# Altium project THERMO_RTD_SENSOR_2CH.PrjPcb
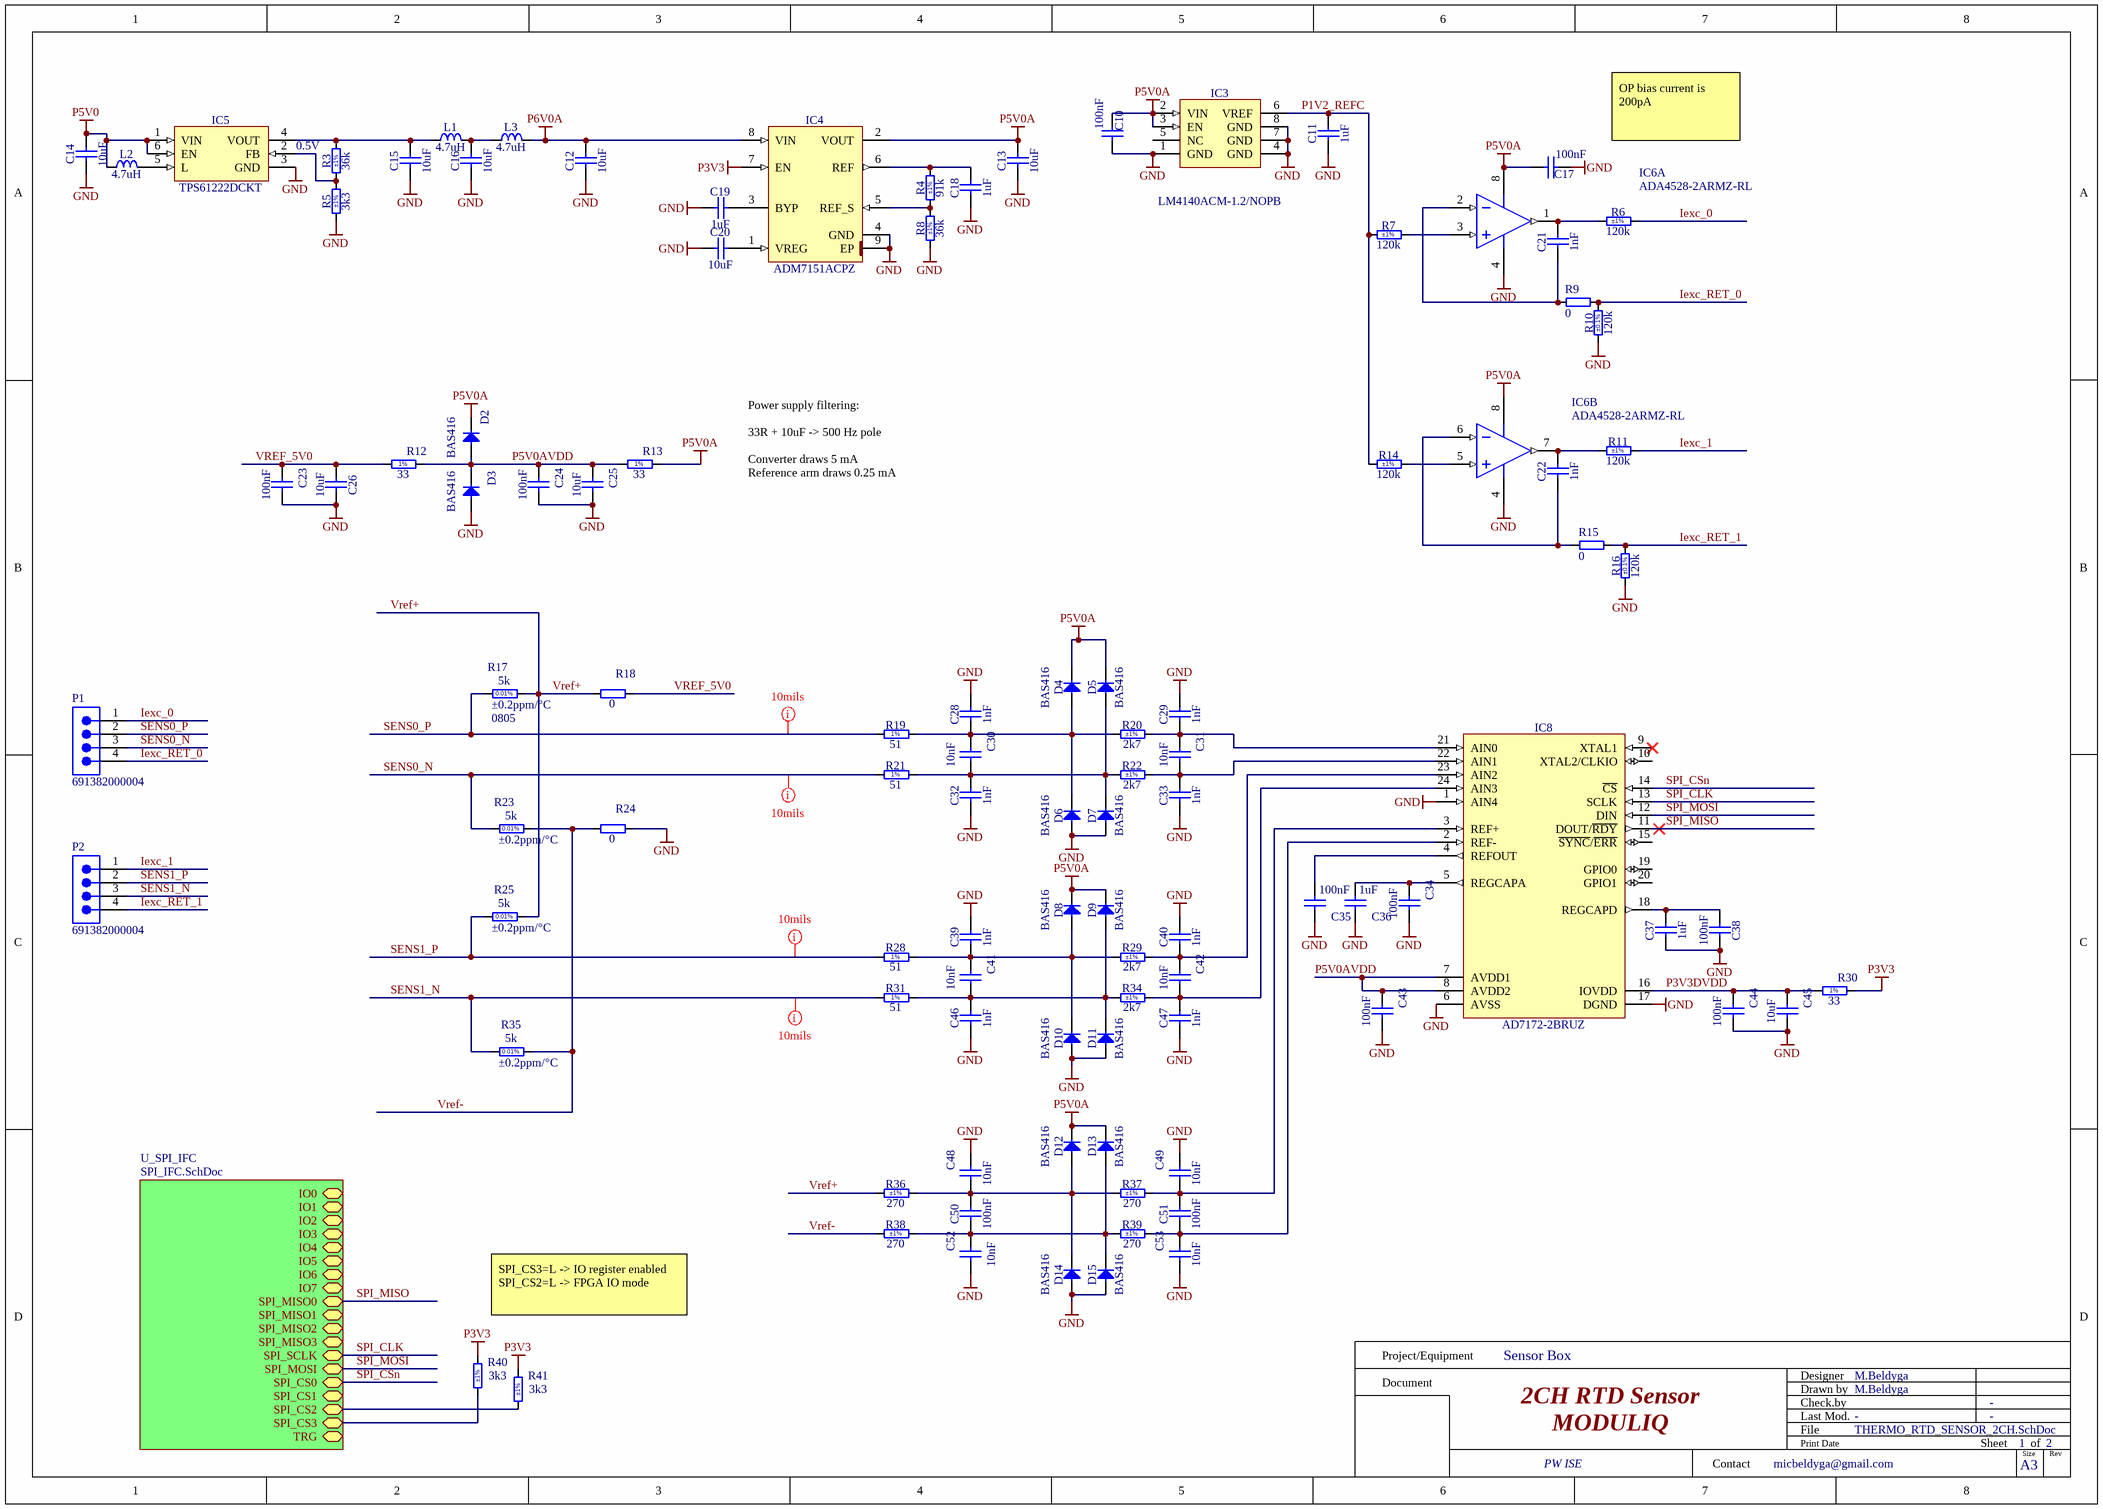
[diagram p0: THERMO_RTD_SENSOR_2CH.SchDoc]
2 sheets, 154 parts. Net scope: hierarchical (ports join the sheet entries above them; power ports are global).
Board file: MODULIQ_Thermometer.PcbDoc
Sheets:
  THERMO_RTD_SENSOR_2CH.SchDoc
    U_SPI_IFC = SPI_IFC.SchDoc

## Sheet THERMO_RTD_SENSOR_2CH.SchDoc: 2CH RTD Sensor
size A3; Author: M.Beldyga; CompanyName: WUT ISE; DrawnBy: M.Beldyga; Organization: WUT ISE; Address1: PW ISE; Address2: Nowowiejska 15/19 00-665 Warsaw; Address3: micbeldyga@gmail.com; SheetNumber: 1; SheetTotal: 2; ModifiedBy: -; CheckedDate: -; Title2: MODULIQ; DivGrp: WUT ISE; Designer: M.Beldyga; ModifiedDate: -; ProjectName: Sensor Box

### Parts
C10  100nF  [CAPC1005X55N]
C11  1uF  [CAPC1608X87N]
C12  10uF  [CAPC1608X80N]
C13  10uF  [CAPC1608X80N]
C14  10uF  [CAPC1608X80N]
C15  10uF  [CAPC1608X80N]
C16  10uF  [CAPC1608X80N]
C17  100nF  [CAPC1005X55N]
C18  1uF  [CAPC1005X55N]
C19  1uF  [CAPC1005X55N]
C20  10uF  [CAPC1608X80N]
C21  1nF  [CAPC1005X55N]
C22  1nF  [CAPC1005X55N]
C23  100nF  [CAPC1005X55N]
C24  100nF  [CAPC1005X55N]
C25  10uF  [CAPC2012X135N]
C26  10uF  [CAPC2012X135N]
C28  1nF  [CAPC1608X90N]
C29  1nF  [CAPC1608X90N]
C30  10nF  [CAPC1608X87N]
C31  10nF  [CAPC1608X87N]
C32  1nF  [CAPC1608X90N]
C33  1nF  [CAPC1608X90N]
C34  100nF  [CAPC1005X55N]
C35  100nF  [CAPC1005X55N]
C36  1uF  [CAPC1608X87N]
C37  1uF  [CAPC1608X87N]
C38  100nF  [CAPC1005X55N]
C39  1nF  [CAPC1608X90N]
C40  1nF  [CAPC1608X90N]
C41  10nF  [CAPC1608X87N]
C42  10nF  [CAPC1608X87N]
C43  100nF  [CAPC1005X55N]
C44  100nF  [CAPC1005X55N]
C45  10uF  [CAPC2012X135N]
C46  1nF  [CAPC1608X90N]
C47  1nF  [CAPC1608X90N]
C48  10nF  [CAPC1608X87N]
C49  10nF  [CAPC1608X87N]
C50  100nF  [CAPC1608X87N]
C51  100nF  [CAPC1608X87N]
C52  10nF  [CAPC1608X87N]
C53  10nF  [CAPC1608X87N]
D2  BAS416  [SOD2512X110N]
D3  BAS416  [SOD2512X110N]
D4  BAS416  [SOD2512X110N]
D5  BAS416  [SOD2512X110N]
D6  BAS416  [SOD2512X110N]
D7  BAS416  [SOD2512X110N]
D8  BAS416  [SOD2512X110N]
D9  BAS416  [SOD2512X110N]
D10  BAS416  [SOD2512X110N]
D11  BAS416  [SOD2512X110N]
D12  BAS416  [SOD2512X110N]
D13  BAS416  [SOD2512X110N]
D14  BAS416  [SOD2512X110N]
D15  BAS416  [SOD2512X110N]
IC3  LM4140ACM-1.2/NOPB  [SOIC127P600X175-8N]
IC4  ADM7151ACPZ  [SON50P300X300X80-9N-R170X244]
IC5  TPS61222DCKT  [SOT65P210X110-6N]
IC6  ADA4528-2ARMZ-RL  [ADI-RM-8_N]  (parts A,B of 2)
IC8  AD7172-2BRUZ  [SOP65P640X120-24N]
L1  4.7uH  [INDC2520X120N]
L2  4.7uH  [INDC2520X120N]
L3  4.7uH  [INDC2520X120N]
P1  691382000004  [691382000004]
P2  691382000004  [691382000004]
R3  36k  Tolerance: ±1%  [RESC1005X40N]
R4  91k  Tolerance: ±1%  [RESC1005X40N]
R5  3k3  Tolerance: ±1%  [RESC1005X40N]
R6  120k  Tolerance: ±1%  [RESC1005X40N]
R7  120k  Tolerance: ±1%  [RESC1005X40N]
R8  36k  Tolerance: ±1%  [RESC1005X40N]
R9  0  [RESC1005X40N]
R10  120k  Tolerance: ±0.1%  [RESC2012X60N]
R11  120k  Tolerance: ±1%  [RESC1005X40N]
R12  33  [RESC1005X40N]
R13  33  [RESC1005X40N]
R14  120k  Tolerance: ±1%  [RESC1005X40N]
R15  0  [RESC1005X40N]
R16  120k  Tolerance: ±0.1%  [RESC2012X60N]
R17  5k  TC: ±0.2ppm/°C  Case: 0805  [RESC2013X64N]
R18  0  [RESC1608X55N]
R19  51  [RESC1005X40N]
R20  2k7  Tolerance: ±1%  [RESC1005X40N]
R21  51  [RESC1005X40N]
R22  2k7  Tolerance: ±1%  [RESC1005X40N]
R23  5k  TC: ±0.2ppm/°C  [RESC2013X64N]
R24  0  [RESC1608X55N]
R25  5k  TC: ±0.2ppm/°C  [RESC2013X64N]
R28  51  [RESC1005X40N]
R29  2k7  Tolerance: ±1%  [RESC1005X40N]
R30  33  [RESC1005X40N]
R31  51  [RESC1005X40N]
R34  2k7  Tolerance: ±1%  [RESC1005X40N]
R35  5k  TC: ±0.2ppm/°C  [RESC2013X64N]
R36  270  Tolerance: ±1%  [RESC1005X40N]
R37  270  Tolerance: ±1%  [RESC1005X40N]
R38  270  Tolerance: ±1%  [RESC1005X40N]
R39  270  Tolerance: ±1%  [RESC1005X40N]
R40  3k3  Tolerance: ±1%  [RESC1005X40N]
R41  3k3  Tolerance: ±1%  [RESC1005X40N]

### Sub-sheets
U_SPI_IFC = SPI_IFC.SchDoc: IO0 (bidir), IO1 (bidir), IO2 (bidir), IO3 (bidir), IO4 (bidir), IO5 (bidir), IO6 (bidir), IO7 (bidir), SPI_MISO0 (bidir), SPI_MISO1 (bidir), SPI_MISO2 (bidir), SPI_MISO3 (bidir), SPI_SCLK (bidir), SPI_MOSI (bidir), SPI_CS0 (bidir), SPI_CS1 (bidir), SPI_CS2 (bidir), SPI_CS3 (bidir), TRG (bidir)

### Nets
GND: C10.2 C11.1 C12.1 C13.1 C14.1 C15.1 C16.1 C17.1 C18.1 C19.1 C20.1 C23.2 C24.2 C25.2 C26.2 C28.2 C29.2 C32.1 C33.1 C34.2 C35.2 C36.1 C37.1 C38.2 C39.2 C40.2 C43.2 C44.2 C45.2 C46.1 C47.1 C48.2 C49.2 C52.1 C53.1 D3.2(A) D6.2(A) D7.2(A) D10.2(A) D11.2(A) D14.2(A) D15.2(A) IC3.1(GND) IC3.4(GND) IC3.7(GND) IC3.8(GND) IC4.4(GND) IC4.9(EP) IC5.3(GND) IC6.4(-V) IC8.1(AIN4) IC8.6(AVSS) IC8.17(DGND) R5.1 R8.1 R10.1 R16.1 R24.2
P3V3: IC4.7(EN) R30.2 R40.1 R41.1
P5V0: C14.2 IC5.1(VIN) IC5.6(EN) L2.1
P5V0A: C10.1 C13.2 C17.2 D2.1(C) D4.1(C) D5.1(C) D8.1(C) D9.1(C) D12.1(C) D13.1(C) IC3.2(VIN) IC3.3(EN) IC4.2(VOUT) IC6.8(+V) R13.2
P6V0A: C12.2 IC4.8(VIN) L3.2
Iexc_0: P1.1 R6.2
Iexc_1: P2.1 R11.2
Iexc_RET_0: P1.4 R9.2 R10.2
Iexc_RET_1: P2.4 R15.2 R16.2
P1V2_REFC: C11.2 IC3.6(VREF) R7.1 R14.1
P3V3DVDD: C44.1 C45.1 IC8.16(IOVDD) R30.1
P5V0AVDD: C24.1 C25.1 C43.1 D2.2(A) D3.1(C) IC8.7(AVDD1) IC8.8(AVDD2) R12.2 R13.1
SENS0_N: P1.3 R21.1 R23.1
SENS0_P: P1.2 R17.1 R19.1
SENS1_N: P2.3 R31.1 R35.1
SENS1_P: P2.2 R25.1 R28.1
SPI_CLK: IC8.13(SCLK) ; sheet U_SPI_IFC/SPI_SCLK
SPI_CS2: R41.2 ; sheet U_SPI_IFC/SPI_CS2
SPI_CS3: R40.2 ; sheet U_SPI_IFC/SPI_CS3
SPI_CSn: IC8.14(~{CS}) ; sheet U_SPI_IFC/SPI_CS0  [project net SPI_CS0]
SPI_MISO: IC8.11(DOUT/~{RDY}) ; sheet U_SPI_IFC/SPI_MISO0
SPI_MOSI: IC8.12(DIN) ; sheet U_SPI_IFC/SPI_MOSI
Vref+: R17.2 R18.1 R25.2 R36.1
Vref-: R23.2 R24.1 R35.2 R38.1
VREF_5V0: C23.1 C26.1 R12.1 R18.2
NetC15_2: C15.2 IC5.4(VOUT) L1.1 R3.2
NetC16_2: C16.2 L1.2 L3.1
NetC18_2: C18.2 IC4.6(REF) R4.2
NetC19_2: C19.2 IC4.3(BYP)
NetC20_2: C20.2 IC4.1(VREG)
NetC21_1: C21.1 IC6.2(-IN_A) R9.1
NetC21_2: C21.2 IC6.1(OUT_A) R6.1
NetC22_1: C22.1 IC6.6(-IN_B) R15.1
NetC22_2: C22.2 IC6.7(OUT_B) R11.1
NetC28_1: C28.1 C30.1 D4.2(A) D6.1(C) R19.2 R20.1
NetC29_1: C29.1 C31.1 IC8.21(AIN0) R20.2
NetC30_2: C30.2 C32.2 D5.2(A) D7.1(C) R21.2 R22.1
NetC31_2: C31.2 C33.2 IC8.22(AIN1) R22.2
NetC34_1: C34.1 C36.2 IC8.5(REGCAPA)
NetC35_1: C35.1 IC8.4(REFOUT)
NetC37_2: C37.2 C38.1 IC8.18(REGCAPD)
NetC39_1: C39.1 C41.1 D8.2(A) D10.1(C) R28.2 R29.1
NetC40_1: C40.1 C42.1 IC8.23(AIN2) R29.2
NetC41_2: C41.2 C46.2 D9.2(A) D11.1(C) R31.2 R34.1
NetC42_2: C42.2 C47.2 IC8.24(AIN3) R34.2
NetC48_1: C48.1 C50.2 D12.2(A) D14.1(C) R36.2 R37.1
NetC49_1: C49.1 C51.2 IC8.3(REF+) R37.2
NetC50_1: C50.1 C52.2 D13.2(A) D15.1(C) R38.2 R39.1
NetC51_1: C51.1 C53.2 IC8.2(REF-) R39.2
NetIC4_5: IC4.5(REF_S) R4.1 R8.2
NetIC5_2: IC5.2(FB) R3.1 R5.2
NetIC5_5: IC5.5(L) L2.2
NetIC6_3: IC6.3(+IN_A) R7.2
NetIC6_5: IC6.5(+IN_B) R14.2

Not connected (* = marked no-connect by the designer): IC3 5(NC); IC8 9(XTAL1)* 10(XTAL2/CLKIO) 15(~{SYNC}/~{ERR}) 19(GPIO0) 20(GPIO1)

### Layout directives
rule Width Constraint [Pref Width = 10mil    Min Width = 10mil    Max Width = 15mil]: SENS0_N, SENS0_P, SENS1_N, SENS1_P

### Notes on the sheet
- 0.5V
- OP bias current is 200pA
- Power supply filtering:
  33R + 10uF -> 500 Hz pole
  Converter draws 5 mA
  Reference arm draws 0.25 mA
- SPI_CS3=L -> IO register enabled
  SPI_CS2=L -> FPGA IO mode
- Project/Equipment
- Document
- Designer
- Drawn by
- Check.by
- Contact
- File
- Last Mod.
- Print Date
- Sheet
- Size
- A3
- of
- Rev
- (in symbol R0402_33R_1%_0.0625W_100PPM) 1%
- (in symbol R0402_51R_1%_0.0625W_100PPM) 1%
- (in symbol R0805_5K_0.01%_0.2W_0.2PPM_VISHAY_VSMP) 0.01%

### Library data of the parts
C10 C17 = CC0402_100NF_16V_10%_X5R: Non-polarised capacitor; Part Description: SMD Multilayer Chip Ceramic Capacitor; Manufacturer: GENERIC; Manufacturer1 Part Number: GRM155R61C104KA88D; Voltage: 16V; TC: X5R; Tolerance: ±10%; Part Number: CC0402_100NF_16V_10%_X5R; Component Kind: Standard; Component Type: Standard; Pin Count: 2; Value: 100nF; Status: None; Manufacturer Part Number: CC0402_100NF_16V_10%_X5R; Case: 0402; Mounted: Yes; Socket: No; SMD: Yes; Sense: No; Manufacturer1 Example: MURATA; Manufacturer1 ComponentHeight: 0.55mm; HelpURL: \\cern.ch\dfs\Applications\Altium\Datasheets\CC0402_X5R_MURATA_GRM.pdf; Author: CERN DEM JLC; CreateDate: 10.12.2013; LatestRevisionDate: 10.12.2013
C11 C36 C37 = CC0603_1UF_25V_10%_X7R: Non-polarised capacitor; Part Description: SMD Multilayer Chip Ceramic Capacitor; Manufacturer: GENERIC; Manufacturer1 Part Number: GRM188R71E105KA12D; Voltage: 25V; TC: X7R; Tolerance: ±10%; Part Number: CC0603_1UF_25V_10%_X7R; Component Kind: Standard; Component Type: Standard; Pin Count: 2; Value: 1uF; Status: None; Manufacturer Part Number: CC0603_1UF_25V_10%_X7R; Case: 0603; Mounted: Yes; Socket: No; SMD: Yes; Sense: No; Manufacturer1 Example: MURATA; Manufacturer1 ComponentHeight: 0.9mm; HelpURL: \\cern.ch\dfs\Applications\Altium\Datasheets\CC0603_X7R_MURATA.pdf; Author: CERN DEM JLC; CreateDate: 18/01/2011; LatestRevisionDate: 18/01/2011
C12-C16 C20 = CC0603_10UF_10V_10%_X5R: Non-polarised capacitor; Part Description: SMD Multilayer Chip Ceramic Capacitor; Manufacturer: GENERIC; Manufacturer1 Part Number: GRM188R61A106KE69D; Voltage: 10V; TC: X5R; Tolerance: ±10%; Part Number: CC0603_10UF_10V_10%_X5R; Component Kind: Standard; Component Type: Standard; Pin Count: 2; Value: 10uF; Status: None; Manufacturer Part Number: CC0603_10UF_10V_10%_X5R; Case: 0603; Mounted: Yes; Socket: No; SMD: Yes; Sense: No; Manufacturer1 Example: MURATA; Manufacturer1 ComponentHeight: 0.8mm; HelpURL: \\cern.ch\dfs\Applications\Altium\Datasheets\CC0603_MURATA_GRM188R61A106KE69D.pdf; Author: CERN DEM JLC; CreateDate: 31.01.2017; LatestRevisionDate: 31.01.2017
C18 C19 = CC0402_1UF_16V_10%_X5R: Non-polarised capacitor; Part Description: SMD Multilayer Chip Ceramic Capacitor; Manufacturer: GENERIC; Manufacturer1 Part Number: C1005X5R1C105KT; Voltage: 16V; TC: X5R; Tolerance: ±10%; Part Number: CC0402_1UF_16V_10%_X5R; Component Kind: Standard; Component Type: Standard; Pin Count: 2; Value: 1uF; Status: Preferred; Manufacturer Part Number: CC0402_1UF_16V_10%_X5R; Case: 0402; Mounted: Yes; Socket: No; SMD: Yes; Sense: No; Manufacturer1 Example: TDK; Manufacturer1 ComponentHeight: 0.55mm; HelpURL: \\cern.ch\dfs\Applications\Altium\Datasheets\CC0402_X5R_TDK_C.pdf; Author: CERN DEM JLC; CreateDate: 25.10.2012; LatestRevisionDate: 25.10.2012
C21 C22 = CC0402_1NF_50V_10%_X7R: Non-polarised capacitor; Part Description: SMD Multilayer Chip Ceramic Capacitor; Manufacturer: GENERIC; Manufacturer1 Part Number: 223858715623; Voltage: 50V; TC: X7R; Tolerance: ±10%; Part Number: CC0402_1NF_50V_10%_X7R; Component Kind: Standard; Component Type: Standard; Pin Count: 2; Value: 1nF; Status: Not Recommended; Manufacturer Part Number: CC0402_1NF_50V_10%_X7R; Case: 0402; Mounted: Yes; Socket: No; SMD: Yes; Sense: No; Manufacturer1 Example: PHYCOMP; Manufacturer1 ComponentHeight: 0.55mm; HelpURL: \\cern.ch\dfs\Applications\Altium\Datasheets\CC0402_X7R_PHYCOMP.pdf; Author: CERN DEM JLC; CreateDate: 03/12/2007; LatestRevisionDate: 03/12/2007
C23 C24 C34 C35 C38 C43 C44 = CC0402_100NF_16V_10%_X5R: Non-polarised capacitor; Part Description: SMD Multilayer Chip Ceramic Capacitor; Manufacturer: GENERIC; Manufacturer1 Part Number: GRM155R61C104KA88D; Voltage: 16V; TC: X5R; Tolerance: ±10%; Table: Capacitors SMD; Part Number: CC0402_100NF_16V_10%_X5R; Component Kind: Standard; Component Type: Standard; Pin Count: 2; Value: 100nF; Status: None; Manufacturer Part Number: CC0402_100NF_16V_10%_X5R; Case: 0402; Mounted: Yes; Socket: No; SMD: Yes; Manufacturer1 Example: MURATA; Manufacturer1 ComponentHeight: 0.55mm; HelpURL: \\cern.ch\dfs\Applications\Altium\Datasheets\CC0402_X5R_MURATA_GRM.pdf; Author: CERN DEM JLC; CreateDate: 2013-12-10; LatestRevisionDate: 2013-12-10
C25 C26 C45 = CC0805_10UF_16V_10%_X5R: Non-polarised capacitor; Part Description: SMD Multilayer Chip Ceramic Capacitor; Manufacturer: GENERIC; Manufacturer1 Part Number: C0805C106K4PAC; Voltage: 16V; TC: X5R; Tolerance: ±10%; Part Number: CC0805_10UF_16V_10%_X5R; Component Kind: Standard; Component Type: Standard; Pin Count: 2; Value: 10uF; Status: Preferred; Manufacturer Part Number: CC0805_10UF_16V_10%_X5R; Case: 0805; Mounted: Yes; Socket: No; SMD: Yes; Manufacturer1 Example: KEMET; Manufacturer1 ComponentHeight: 1.4mm; HelpURL: \\cern.ch\dfs\Applications\Altium\Datasheets\CC1206_X5R_KEMET.pdf; Author: CERN DEM JLC; CreateDate: 03.12.2007; LatestRevisionDate: 03.12.2007; Sense: No
C28 C29 C32 C33 C39 C40 C46 C47 = CC0603_1NF_50V_5%_NP0: Non-polarised capacitor; Part Description: SMD Multilayer Chip Ceramic Capacitor; Manufacturer: GENERIC; Manufacturer1 Part Number: CC0603JRNPO9BN102; Voltage: 50V; TC: C0G/NP0; Tolerance: ±5%; Part Number: CC0603_1NF_50V_5%_NP0; Component Kind: Standard; Component Type: Standard; Pin Count: 2; Value: 1nF; Status: Preferred; Manufacturer Part Number: CC0603_1NF_50V_5%_NP0; Case: 0603; Mounted: Yes; Socket: No; SMD: Yes; Sense: No; Manufacturer1 Example: YAGEO PHYCOMP; Manufacturer1 ComponentHeight: 0.9mm; HelpURL: \\cern.ch\dfs\Applications\Altium\Datasheets\CC0805_NP0_PHYCOMP_16VTO50V.pdf; Author: CERN DEM JLC; CreateDate: 22.10.2012; LatestRevisionDate: 22.10.2012
C30 C31 C41 C42 C48 C49 C52 C53 = CC0603_10NF_50V_5%_C0G: Non-polarised capacitor; Part Description: SMD Multilayer Chip Ceramic Capacitor; Manufacturer: GENERIC; Manufacturer1 Part Number: C1608C0G1H103J080AA; Voltage: 50V; TC: C0G/NP0; Tolerance: ±5%; Part Number: CC0603_10NF_50V_5%_C0G; Component Kind: Standard; Component Type: Standard; Pin Count: 2; Value: 10nF; Status: Preferred; Manufacturer Part Number: CC0603_10NF_50V_5%_C0G; Case: 0603; Mounted: Yes; Socket: No; SMD: Yes; Manufacturer1 Example: TDK; Manufacturer1 ComponentHeight: 0.9mm; HelpURL: \\cern.ch\dfs\Applications\Altium\Datasheets\CC0603_C0G_TDK_C.pdf; Author: CERN DEM JLC; Sense: No
  C30 C31 C41 C42: CreateDate: 10.12.2014; LatestRevisionDate: 10.12.2014
  C48 C49 C52 C53: CreateDate: 10/12/2014; LatestRevisionDate: 10/12/2014
C50 C51 = CC0603_100NF_50V_10%_X5R: Non-polarised capacitor; Part Description: SMD Multilayer Chip Ceramic Capacitor; Manufacturer: GENERIC; Manufacturer1 Part Number: C1608X5R1H104K080; Voltage: 50V; TC: X5R; Tolerance: ±10%; Part Number: CC0603_100NF_50V_10%_X5R; Component Kind: Standard; Component Type: Standard; Pin Count: 2; Value: 100nF; Status: None; Manufacturer Part Number: CC0603_100NF_50V_10%_X5R; Case: 0603; Mounted: Yes; Socket: No; SMD: Yes; Sense: No; Manufacturer1 Example: TDK; Manufacturer1 ComponentHeight: 0.9mm; HelpURL: \\cern.ch\dfs\Applications\Altium\Datasheets\CC0603_X5R_TDK_C.pdf; Author: CERN DEM MR; CreateDate: 08.01.2016; LatestRevisionDate: 08.01.2016
D2-D15 = BAS416: Diode; Part Description: Low-Leakage Diode; Manufacturer: NXP SEMICONDUCTORS; Voltage: 75V; Power: 200mA; PressFit: No; Bonding: No; Part Number: BAS416; Component Kind: Standard; Component Type: Standard; Device: BAS416; PackageDescription: Small Outline Diode (SOD-323), 1.70mm W X 1.25mm L X 1.10mm H body,  IPC Medium Density; Manufacturer Part Number: BAS416; Pin Count: 2; Case: SOD323; Mounted: Yes; Socket: No; SMD: Yes; Sense: No; ComponentHeight: 1.1mm; HelpURL: \\cern.ch\dfs\Applications\Altium\Datasheets\BAS416.pdf; Author: CERN DEM JLC; CreateDate: 01/10/2013; LatestRevisionDate: 01/10/2013
IC3 = LM4140ACM-1.2/NOPB: High Precision Low Noise Low Dropout Voltage Reference; Part Description: 1.2V 0.1% 3 ppm/°C, High Precision Low Noise Low Dropout Voltage Reference; Manufacturer: TEXAS INSTRUMENTS; PressFit: No; Bonding: No; Part Number: LM4140ACM-1.2/NOPB; Component Kind: Standard; Component Type: Standard; Device: LM4140ACM-1.2/NOPB; PackageDescription: SOIC 8, Pitch 1.27mm, Body 4x5mm, IPC Medium Density; Manufacturer Part Number: LM4140ACM-1.2/NOPB; Pin Count: 8; Case: SOIC8; Mounted: Yes; Socket: No; SMD: Yes; Sense: No; ComponentHeight: 1.75mm; HelpURL: \\cern.ch\dfs\Applications\Altium\Datasheets\LM4140ACM-1.2-NOPB.pdf; Author: CERN DEM JLC; CreateDate: 17.11.2014; LatestRevisionDate: 17.11.2014
IC4 = ADM7151ACPZ: 800 mA Ultralow Noise, High PSRR, RF Linear Regulator; Part Description: Adjustable 1.5V to 5.1V, 800 mA Ultralow Noise, High PSRR, RF Linear Regulator; Manufacturer: ANALOG DEVICES; PressFit: No; Bonding: No; Part Number: ADM7151ACPZ; Component Kind: Standard; Component Type: Standard; Device: ADM7151ACPZ; PackageDescription: SON, (DFN) 0.50mm Pitch; 8 pin, 3.00mm W X 3.00mm L X 0.80mm H body (w/Thermal Tab 1.70 X2.44mm), IPC Medium Density; Manufacturer Part Number: ADM7151ACP; Pin Count: 9; Case: SON8; Mounted: Yes; Socket: No; SMD: Yes; Sense: No; ComponentHeight: 0.8mm; HelpURL: \\cern.ch\dfs\Applications\Altium\Datasheets\ADM7151ACPZ.pdf; Author: CERN DEM JLC; CreateDate: 23.04.2015; LatestRevisionDate: 31.03.2022
IC5 = TPS61222DCKT: Low Input Voltage, 0.7V Boost Converter With 5.5uA Quiescent Current; Manufacturer: TEXAS INSTRUMENTS; PressFit: No; Bonding: No; Part Number: TPS61222DCKT; Component Kind: Standard; Component Type: Standard; Device: TPS61222DCKT; PackageDescription: SOT353, SC70-6, 0.65mm Pitch; 6 Pin, 1.25mm W X 2.00mm L X 1.10mm H body, IPC Medium Density; Part Description: Low Input Voltage, 0.7V Boost Converter with 5.5uA Quiescent Current; Manufacturer Part Number: TPS61222DCK; Pin Count: 6; Case: SOT363; Mounted: Yes; Socket: No; SMD: Yes; Sense: No; ComponentHeight: 1.1mm; HelpURL: \\cern.ch\dfs\Applications\Altium\Datasheets\TPS61222DCKT.pdf; Author: CERN DEM BC; CreateDate: 27.02.2017; LatestRevisionDate: 13.06.2022
IC6 = CMP-0384-01794-1: Double Channel RRIO Operational Amplifier, 3.4 MHz BW, 500 mV/us SR, Industrial, 8-pin SOP (RM-8), Reel; Manufacturer: Analog Devices; V Span Max: 5.5V; Iq/Amp: 1.5mA; Amplifiers Per Package: 2; Input Bias Current: 125pA; V Span Min: 2.2V; Small Signal Bandwidth: 3.4MHz; Input Offset Voltage: 300nV; Code_JEDEC: MO-187-AA; PackageReference: RM-8; ComponentLink3Description: Package Specification; Slew Rate: 500mV/us; Manufacturer Part Number: ADA4528-2ARMZ-RL; ComponentLink2Description: Datasheet; Generic Part Number: ADA4528-2; DatasheetVersion: Rev. C; ComponentLink1URL: http://www.analog.com/en/index.html; Packing: Reel; ComponentLink3URL: http://www.analog.com/static/imported-files/packages/PKG_PDF/MSOP%28RM%29/RM_8.pdf; PackageDescription: 8-Pin Mini Small Outline Package, Body 3 x 3 mm, Pitch 0.65 mm; ComponentLink2URL: http://www.analog.com/static/imported-files/data_sheets/ADA4528-1_4528-2.pdf; ComponentLink1Description: Manufacturer URL; Mounting Technology: Surface Mount
IC8 = ADC_AD7172-2: 32-Bit, 10 kSPS, Sigma-Delta ADC with 100 µs Settling and True Rail-to-Rail Buffers; Part Description: Low Power, 24-Bit, 31.25 kSPS, Sigma-DeltaADC with True Rail-to-Rail Buffers; Manufacturer: ANALOG DEVICES; PressFit: No; Bonding: No; Part Number: AD7172-2BRUZ; Component Kind: Standard; Component Type: Standard; Device: AD7172-2BRUZ; PackageDescription: SOP, 0.65mm Pitch; 24 Pin, 4.40mm W X 5.00mm L X 1.20mm H Body IPC Medium Density; Manufacturer Part Number: AD7172-2BRUZ; Pin Count: 24; Case: TSSOP24; Mounted: Yes; Socket: No; SMD: Yes; Sense: No; ComponentHeight: 1.2mm; Author: GK; HelpURL: \\cern.ch\dfs\Applications\Altium\Datasheets\AD7177-2BRUZ.pdf; CreateDate: 14/12/2017; LatestRevisionDate: 14/12/2017
L1-L3 = IND1008_4.7UH_20%_MURATA_DFE252012P: Inductor; Part Description: Metal Alloy Power Inductor (DFE252012P Series); Manufacturer: MURATA; Manufacturer Part Number: DFE252012P-4R7M; Power: 2A; Resistance: 0.2R; Tolerance: ±20%; Part Number: IND1008_4.7UH_20%_MURATA_DFE252012P; Component Kind: Standard; Component Type: Standard; Pin Count: 2; Value: 4.7uH; Case: 1008; Mounted: Yes; Socket: No; SMD: Yes; Sense: No; ComponentHeight: 1.2mm; HelpURL: \\cern.ch\dfs\Applications\Altium\Datasheets\IND_MURATA_DFE252012P-4R7M.pdf; Author: CERN DEM BC; CreateDate: 03.09.2020; LatestRevisionDate: 03.09.2020
P1 P2 = 691382000004: WR-TBL Series 382 Vertical PCB Header, THT, pitch 2.5mm, 4p; Manufacturer: Wurth Elektronik; Modularity: No; Rated Current: 4A; Working Voltage: 300V; Manufacturer Part Number: 691382000004; Category: Terminal Blocks; Match Code: WR-TBL; ComponentLink1Description: Website Link; ComponentLink1URL: https://www.we-online.com/redexpert/article/691382000004?ad; ComponentLink2Description: Datasheet Link; ComponentLink2URL: https://www.we-online.com/redexpert/spec/691382000004?ad; Mount: Through Hole; Operating Temperature Max: 105°C; Operating Temperature Min: -40°C; Packaging: Box; Application: Pluggable; Number of Pins: 4; Number of Rows: 1; Orientation: Vertical; Pitch: 2.5mm
R3 R8 = R0402_36K_1%_0.0625W_100PPM: Resistor - 1%; Part Description: General Purpose Thick Film Chip Resistor; Manufacturer: GENERIC; Manufacturer1 Part Number: 232270673603L; TC: ±100ppm/°C; PressFit: No; Part Number: R0402_36K_1%_0.0625W_100PPM; Component Kind: Standard; Component Type: Standard; Pin Count: 2; Value: 36k; Status: Not Recommended; Power: 0.0625W; Manufacturer Part Number: R0402_36K_1%_0.0625W_100PPM; Case: 0402; Mounted: Yes; Sense: No; Socket: No; SMD: Yes; Manufacturer1 Example: YAGEO PHYCOMP; Manufacturer1 ComponentHeight: 0.4mm; HelpURL: \\cern.ch\dfs\Applications\Altium\Datasheets\R0402_Phycomp_RC0402.pdf; Author: CERN DEM JLC; CreateDate: 03.12.2007; LatestRevisionDate: 17.10.2012
R4 = R0402_91K_1%_0.0625W_100PPM: Resistor - 1%; Part Description: General Purpose Thick Film Chip Resistor; Manufacturer: GENERIC; Manufacturer1 Part Number: 232270679103L; TC: ±100ppm/°C; PressFit: No; Part Number: R0402_91K_1%_0.0625W_100PPM; Component Kind: Standard; Component Type: Standard; Pin Count: 2; Value: 91k; Status: Not Recommended; Power: 0.0625W; Manufacturer Part Number: R0402_91K_1%_0.0625W_100PPM; Case: 0402; Mounted: Yes; Sense: No; Socket: No; SMD: Yes; Manufacturer1 Example: YAGEO PHYCOMP; Manufacturer1 ComponentHeight: 0.4mm; HelpURL: \\cern.ch\dfs\Applications\Altium\Datasheets\R0402_Phycomp_RC0402.pdf; Author: CERN DEM JLC; CreateDate: 03.12.2007; LatestRevisionDate: 17.10.2012
R5 R40 R41 = R0402_3K3_1%_0.0625W_100PPM: Resistor - 1%; Part Description: General Purpose Thick Film Chip Resistor; Manufacturer: GENERIC; Manufacturer1 Part Number: 232270673302L; TC: ±100ppm/°C; PressFit: No; Part Number: R0402_3K3_1%_0.0625W_100PPM; Component Kind: Standard; Component Type: Standard; Pin Count: 2; Value: 3k3; Status: Not Recommended; Power: 0.0625W; Manufacturer Part Number: R0402_3K3_1%_0.0625W_100PPM; Case: 0402; Mounted: Yes; Sense: No; Socket: No; SMD: Yes; Manufacturer1 Example: YAGEO PHYCOMP; Manufacturer1 ComponentHeight: 0.4mm; HelpURL: \\cern.ch\dfs\Applications\Altium\Datasheets\R0402_Phycomp_RC0402.pdf; Author: CERN DEM JLC; CreateDate: 03.12.2007; LatestRevisionDate: 17.10.2012
R6 R7 R11 R14 = R0402_120K_1%_0.0625W_100PPM: Resistor - 1%; Part Description: General Purpose Thick Film Chip Resistor; Manufacturer: GENERIC; Manufacturer1 Part Number: 232270671204L; TC: ±100ppm/°C; PressFit: No; Part Number: R0402_120K_1%_0.0625W_100PPM; Component Kind: Standard; Component Type: Standard; Pin Count: 2; Value: 120k; Status: Not Recommended; Power: 0.0625W; Manufacturer Part Number: R0402_120K_1%_0.0625W_100PPM; Case: 0402; Mounted: Yes; Sense: No; Socket: No; SMD: Yes; Manufacturer1 Example: YAGEO PHYCOMP; Manufacturer1 ComponentHeight: 0.4mm; HelpURL: \\cern.ch\dfs\Applications\Altium\Datasheets\R0402_Phycomp_RC0402.pdf; Author: CERN DEM JLC; CreateDate: 03.12.2007; LatestRevisionDate: 17.10.2012
R9 R15 = R0402_0R_JUMPER: Resistor; Part Description: 1A (0.05R Max DC Resistance) Zero Ohm Jumper; Manufacturer: GENERIC; Manufacturer1 Part Number: 232270591001L; PressFit: No; Part Number: R0402_0R_JUMPER; Component Kind: Standard; Component Type: Standard; Pin Count: 2; Value: 0; Status: Not Recommended; Manufacturer Part Number: R0402_0R_JUMPER; Case: 0402; Mounted: Yes; Sense: No; Socket: No; SMD: Yes; Manufacturer1 Example: YAGEO PHYCOMP; Manufacturer1 ComponentHeight: 0.4mm; HelpURL: \\cern.ch\dfs\Applications\Altium\Datasheets\R0402_Phycomp_RC0402.pdf; Author: CERN DEM JLC; CreateDate: 12/3/2007; LatestRevisionDate: 10/17/2012
R10 R16 = R0805_120K_0.1%_0.125W_25PPM: Resistor - 0.1%; Part Description: Thin Film Chip Resistor; Manufacturer: GENERIC; Manufacturer1 Part Number: ERA6AEB124V; Power: 0.125W; TC: ±25ppm; PressFit: No; Part Number: R0805_120K_0.1%_0.125W_25PPM; Component Kind: Standard; Component Type: Standard; Pin Count: 2; Value: 120k; Status: Not Recommended; Manufacturer Part Number: R0805_120K_0.1%_0.125W_25PPM; Case: 0805; Mounted: Yes; Sense: No; Socket: No; SMD: Yes; Manufacturer1 Example: PANASONIC; Manufacturer1 ComponentHeight: 0.6mm; HelpURL: \\cern.ch\dfs\Applications\Altium\Datasheets\R0805_PANASONIC_ERA.pdf; Author: CERN DEM JLC; CreateDate: 04.06.2015; LatestRevisionDate: 04.06.2015
R12 R13 R30 = R0402_33R_1%_0.0625W_100PPM: Resistor - 1%; Part Description: General Purpose Thick Film Chip Resistor; Manufacturer: GENERIC; Manufacturer1 Part Number: 232270673309L; TC: ±100ppm/°C; PressFit: No; Part Number: R0402_33R_1%_0.0625W_100PPM; Component Kind: Standard; Component Type: Standard; Pin Count: 2; Value: 33; Status: Not Recommended; Power: 0.0625W; Tolerance: ±1%; Manufacturer Part Number: R0402_33R_1%_0.0625W_100PPM; Case: 0402; Mounted: Yes; Sense: No; Socket: No; SMD: Yes; Manufacturer1 Example: YAGEO PHYCOMP; Manufacturer1 ComponentHeight: 0.4mm; HelpURL: \\cern.ch\dfs\Applications\Altium\Datasheets\R0402_Phycomp_RC0402.pdf; Author: CERN DEM JLC; CreateDate: 03/12/2007; LatestRevisionDate: 17/10/2012
R17 R23 R25 R35 = R0805_5K_0.01%_0.2W_0.2PPM_VISHAY_VSMP: Resistor - 0.01%; Part Description: Ultra High Precision Foil Wraparound Surface Mount Chip Resistor; Manufacturer: VISHAY PRECISION; Manufacturer Part Number: Y16245K00000T9R; Power: 0.2W; PressFit: No; Part Number: R0805_5K_0.01%_0.2W_0.2PPM_VISHAY_VSMP; Component Kind: Standard; Component Type: Standard; Pin Count: 2; Value: 5k; Status: None; Tolerance: ±0.01%; Mounted: Yes; Sense: No; Socket: No; SMD: Yes; Manufacturer1 ComponentHeight: 0.64mm; HelpURL: \\cern.ch\dfs\Applications\Altium\Datasheets\R0805_VISHAY_VSMP.pdf; Author: CERN DEM JLC; CreateDate: 22.09.2011; LatestRevisionDate: 22.09.2011
  R23 R25 R35: Case: 0805
R18 R24 = R0603_0R_JUMPER: Resistor; Part Description: 1A (0.05R Max DC Resistance) Zero Ohm Jumper; Manufacturer: GENERIC; Manufacturer1 Part Number: NRC06Z0; PressFit: No; Part Number: R0603_0R_JUMPER; Component Kind: Standard; Component Type: Standard; Pin Count: 2; Value: 0; Status: Preferred; Manufacturer Part Number: R0603_0R_JUMPER; Case: 0603; Mounted: Yes; Sense: No; Socket: No; SMD: Yes; Manufacturer1 Example: NIC COMPONENT; Manufacturer1 ComponentHeight: 0.55mm; HelpURL: \\cern.ch\dfs\Applications\Altium\Datasheets\R0603_NIC_NRC.pdf; Author: CERN DEM JLC; CreateDate: 03.12.2007; LatestRevisionDate: 13.03.2008
R19 R21 R28 R31 = R0402_51R_1%_0.0625W_100PPM: Resistor - 1%; Part Description: General Purpose Thick Film Chip Resistor; Manufacturer: GENERIC; Manufacturer1 Part Number: 232270675109L; TC: ±100ppm/°C; PressFit: No; Part Number: R0402_51R_1%_0.0625W_100PPM; Component Kind: Standard; Component Type: Standard; Pin Count: 2; Value: 51; Status: Not Recommended; Power: 0.0625W; Tolerance: ±1%; Manufacturer Part Number: R0402_51R_1%_0.0625W_100PPM; Case: 0402; Mounted: Yes; Sense: No; Socket: No; SMD: Yes; Manufacturer1 Example: YAGEO PHYCOMP; Manufacturer1 ComponentHeight: 0.4mm; HelpURL: \\cern.ch\dfs\Applications\Altium\Datasheets\R0402_Phycomp_RC0402.pdf; Author: CERN DEM JLC; CreateDate: 03/12/2007; LatestRevisionDate: 17/10/2012
R20 R22 R29 R34 = R0402_2K4_1%_0.0625W_100PPM: Resistor - 1%; Part Number: R0402_2K7_1%_0.0625W_100PPM; Part Description: General Purpose Thick Film Chip Resistor; Manufacturer: GENERIC; Manufacturer1 Part Number: 232270672702L; TC: ±100ppm/°C; PressFit: No; Component Kind: Standard; Component Type: Standard; Pin Count: 2; Value: 2k7; Status: Not Recommended; Power: 0.0625W; Manufacturer Part Number: R0402_2K7_1%_0.0625W_100PPM; Case: 0402; Mounted: Yes; Sense: No; Socket: No; SMD: Yes; Manufacturer1 Example: YAGEO PHYCOMP; Manufacturer1 ComponentHeight: 0.4mm; HelpURL: \\cern.ch\dfs\Applications\Altium\Datasheets\R0402_Phycomp_RC0402.pdf; Author: CERN DEM JLC; CreateDate: 03.12.2007; LatestRevisionDate: 17.10.2012
R36-R39 = R0402_270R_1%_0.0625W_100PPM: Resistor - 1%; Part Description: General Purpose Thick Film Chip Resistor; Manufacturer: GENERIC; Manufacturer1 Part Number: 232270672701L; TC: ±100ppm/°C; PressFit: No; Part Number: R0402_270R_1%_0.0625W_100PPM; Component Kind: Standard; Component Type: Standard; Pin Count: 2; Value: 270; Status: Not Recommended; Power: 0.0625W; Manufacturer Part Number: R0402_270R_1%_0.0625W_100PPM; Case: 0402; Mounted: Yes; Sense: No; Socket: No; SMD: Yes; Manufacturer1 Example: YAGEO PHYCOMP; Manufacturer1 ComponentHeight: 0.4mm; HelpURL: \\cern.ch\dfs\Applications\Altium\Datasheets\R0402_Phycomp_RC0402.pdf; Author: CERN DEM JLC; CreateDate: 03.12.2007; LatestRevisionDate: 17.10.2012

## Sheet SPI_IFC.SchDoc: Title
size 420 x 297 mm; Author: G.Kasprowicz; CompanyName: WUT ISE; DrawnBy: G.Kasprowicz; Organization: WUT ISE; Address1: PW ISE; Address2: Nowowiejska 15/19 00-665 Warsaw; Address3: gkasprow@gmail.com; Revision: 1.0; SheetNumber: 2; SheetTotal: 2; ModifiedBy: -; CheckedDate: -; Title2: Title2; DivGrp: WUT ISE; Designer: G.Kasprowicz; SPICEModelCacheRYPVXPCY: <root> / <DocumentId>RYPVXPCY</DocumentId> / </root>; ModifiedDate: -; ProjectName: Sensor Box
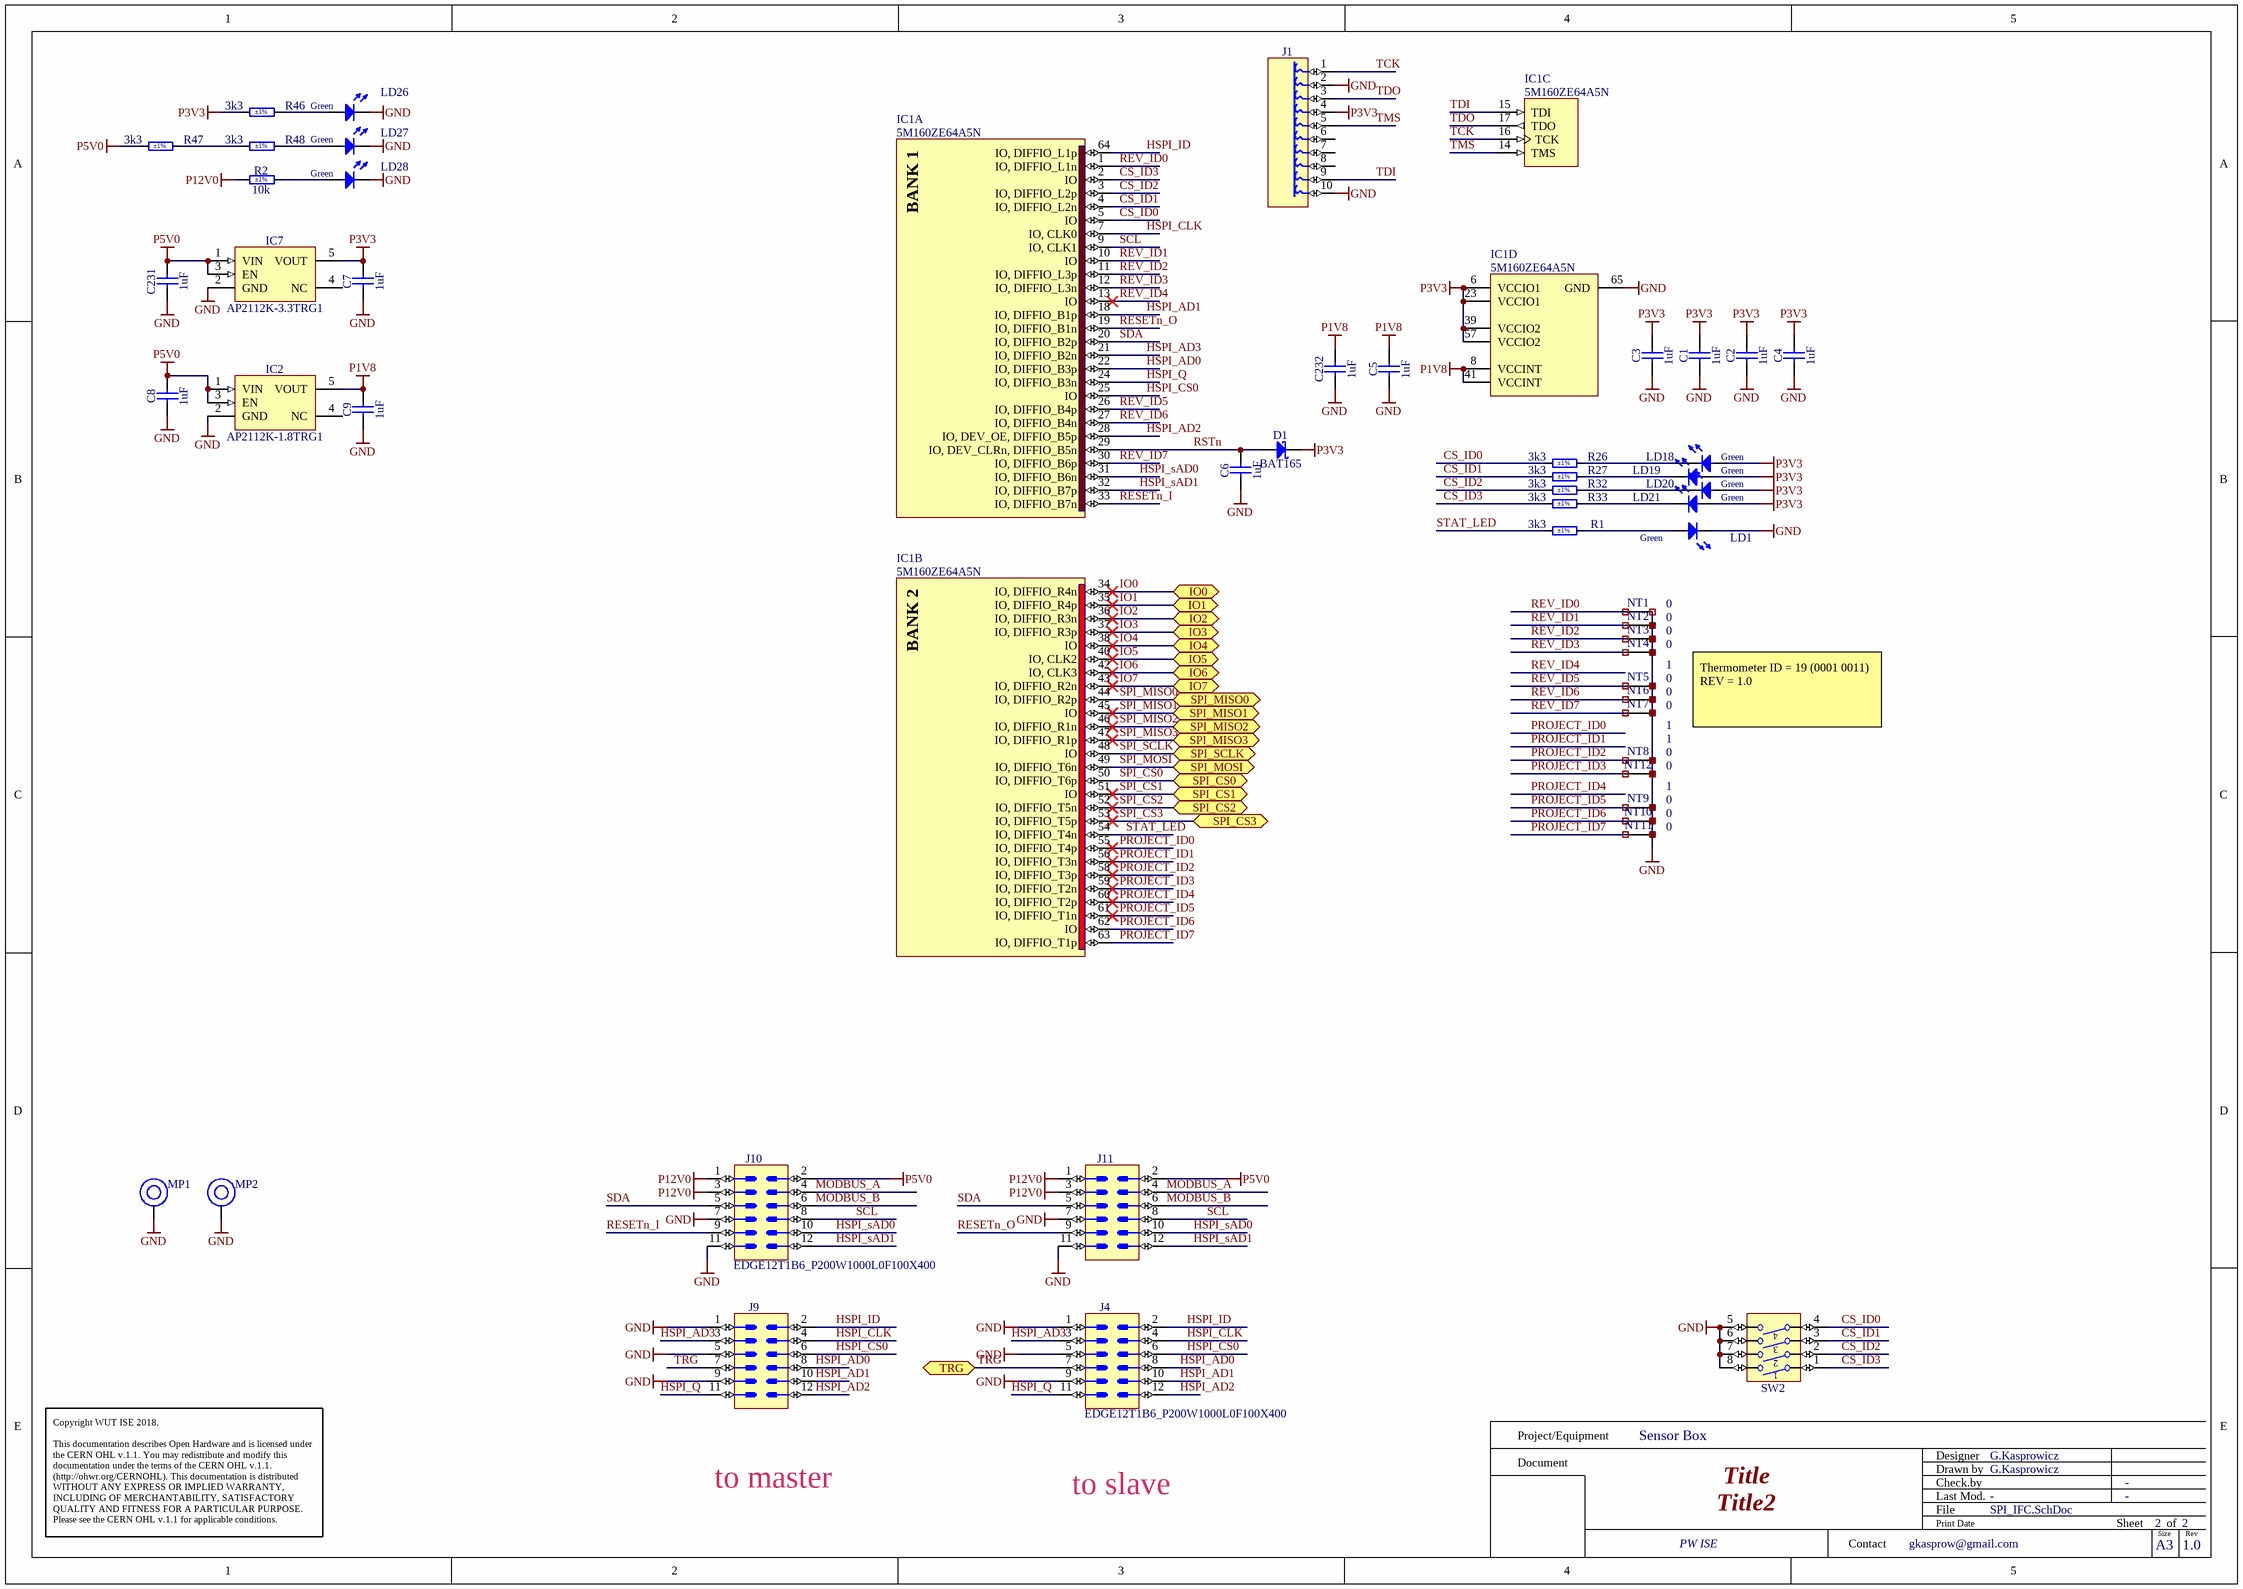
[diagram p1: SPI_IFC.SchDoc]

### Parts
C1  1uF  [CAPC1005X55N]
C2  1uF  [CAPC1005X55N]
C3  1uF  [CAPC1005X55N]
C4  1uF  [CAPC1005X55N]
C5  1uF  [CAPC1005X55N]
C6  1uF  [CAPC1005X55N]
C7  1uF  [CAPC1005X55N]
C8  1uF  [CAPC1005X55N]
C9  1uF  [CAPC1005X55N]
C231  1uF  [CAPC1005X55N]
C232  1uF  [CAPC1005X55N]
D1  BAT165  [SOD2512X110N]
IC1  5M160ZE64A5N  [QFP40P900X900X120-65N-S550]  (parts A,B,C,D of 4)
IC2  AP2112K-1.8TRG1  [SOT95P285X140-5N]
IC7  AP2112K-3.3TRG1  [SOT95P285X140-5N]
J1  TC2050-IDC  [TC2050-IDC]  (value not drawn)
J4  (no value)  [EDGE12T1B6_P200W1000L0F100X400]
J9  (no value)  [EDGE12T5B10_P200W1000L0F100X400]
J10  (no value)  [EDGE12T1B6_P200W1000L0F100X400]
J11  (no value)  [EDGE12T5B10_P200W1000L0F100X400]
LD1  Green  [LED_KINGBRIGHT_KP-1608CGCK]
LD18  Green  [LED_KINGBRIGHT_KP-1608CGCK]
LD19  Green  [LED_KINGBRIGHT_KP-1608CGCK]
LD20  Green  [LED_KINGBRIGHT_KP-1608CGCK]
LD21  Green  [LED_KINGBRIGHT_KP-1608CGCK]
LD26  Green  [LED_KINGBRIGHT_KP-1608CGCK]
LD27  Green  [LED_KINGBRIGHT_KP-1608CGCK]
LD28  Green  [LED_KINGBRIGHT_KP-1608CGCK]
MP1  M1.6 x 3mm  [97730306330]  (value not drawn)
MP2  M1.6 x 3mm  [97730306330]  (value not drawn)
NT1  Net Tie  [Net Tie 3]  (value not drawn)  (net tie, no BOM)
NT2  Net Tie  [Net Tie 3]  (value not drawn)  (net tie, no BOM)
NT3  Net Tie  [Net Tie 3]  (value not drawn)  (net tie, no BOM)
NT4  Net Tie  [Net Tie 3]  (value not drawn)  (net tie, no BOM)
NT5  Net Tie  [Net Tie 3]  (value not drawn)  (net tie, no BOM)
NT6  Net Tie  [Net Tie 3]  (value not drawn)  (net tie, no BOM)
NT7  Net Tie  [Net Tie 3]  (value not drawn)  (net tie, no BOM)
NT8  Net Tie  [Net Tie 3]  (value not drawn)  (net tie, no BOM)
NT9  Net Tie  [Net Tie 3]  (value not drawn)  (net tie, no BOM)
NT10  Net Tie  [Net Tie 3]  (value not drawn)  (net tie, no BOM)
NT11  Net Tie  [Net Tie 3]  (value not drawn)  (net tie, no BOM)
NT12  Net Tie  [Net Tie 3]  (value not drawn)  (net tie, no BOM)
R1  3k3  Tolerance: ±1%  [RESC1005X40N]
R2  10k  Tolerance: ±1%  [RESC1005X40N]
R26  3k3  Tolerance: ±1%  [RESC1005X40N]
R27  3k3  Tolerance: ±1%  [RESC1005X40N]
R32  3k3  Tolerance: ±1%  [RESC1005X40N]
R33  3k3  Tolerance: ±1%  [RESC1005X40N]
R46  3k3  Tolerance: ±1%  [RESC1005X40N]
R47  3k3  Tolerance: ±1%  [RESC1005X40N]
R48  3k3  Tolerance: ±1%  [RESC1005X40N]
SW2  Switch  [SW_OMRON_A6H-4102]  (value not drawn)

### Ports
IO0 (bidir), IO1 (bidir), IO2 (bidir), IO3 (bidir), IO4 (bidir), IO5 (bidir), IO6 (bidir), IO7 (bidir), SPI_CS0 (bidir), SPI_CS1 (bidir), SPI_CS2 (bidir), SPI_CS3 (bidir), SPI_MISO0 (bidir), SPI_MISO1 (bidir), SPI_MISO2 (bidir), SPI_MISO3 (bidir), SPI_MOSI (bidir), SPI_SCLK (bidir), TRG (bidir)

### Nets
GND: C1.1 C2.1 C3.1 C4.1 C5.1 C6.1 C7.1 C8.1 C9.1 C231.1 C232.1 IC1.65(GND) IC2.2(GND) IC7.2(GND) J1.2 J1.10 J4.1 J4.5 J4.9 J9.1 J9.5 J9.9 J10.7 J10.11 J11.7 J11.11 LD1.1(C) LD26.1(C) LD27.1(C) LD28.1(C) MP1.1 MP2.1 NT1.2 NT2.2 NT3.2 NT4.2 NT5.2 NT6.2 NT7.2 NT8.2 NT9.2 NT10.2 NT11.2 NT12.2 SW2.5 SW2.6 SW2.7 SW2.8
P1V8: C5.2 C9.2 C232.2 IC1.8(VCCINT) IC1.41(VCCINT) IC2.5(VOUT)
P3V3: C1.2 C2.2 C3.2 C4.2 C7.2 D1.1(C) IC1.6(VCCIO1) IC1.23(VCCIO1) IC1.39(VCCIO2) IC1.57(VCCIO2) IC7.5(VOUT) J1.4 LD18.2(A) LD19.2(A) LD20.2(A) LD21.2(A) R46.2
P5V0: C8.2 C231.2 IC2.1(VIN) IC2.3(EN) IC7.1(VIN) IC7.3(EN) J10.2 J11.2 R47.2
P12V0: J10.1 J10.3 J11.1 J11.3 R2.1
CS_ID0: IC1.5(IO) R26.2 SW2.4
CS_ID1: IC1.4(IO,_DIFFIO_L2n) R27.2 SW2.3
CS_ID2: IC1.3(IO,_DIFFIO_L2p) R32.2 SW2.2
CS_ID3: IC1.2(IO) R33.2 SW2.1
HSPI_AD0: IC1.22(IO,_DIFFIO_B3p) J4.8 J9.8
HSPI_AD1: IC1.18(IO,_DIFFIO_B1p) J4.10 J9.10
HSPI_AD2: IC1.28(IO,_DEV_OE,_DIFFIO_B5p) J4.12 J9.12
HSPI_AD3: IC1.21(IO,_DIFFIO_B2n) J4.3 J9.3
HSPI_CLK: IC1.7(IO,_CLK0) J4.4 J9.4
HSPI_CS0: IC1.25(IO) J4.6 J9.6
HSPI_ID: IC1.64(IO,_DIFFIO_L1p) J4.2 J9.2
HSPI_Q: IC1.24(IO,_DIFFIO_B3n) J4.11 J9.11
HSPI_sAD0: IC1.31(IO,_DIFFIO_B6n) J10.10 J11.10
HSPI_sAD1: IC1.32(IO,_DIFFIO_B7p) J10.12 J11.12
IO0: IC1.34(IO,_DIFFIO_R4n) ; port IO0
IO1: IC1.35(IO,_DIFFIO_R4p) ; port IO1
IO2: IC1.36(IO,_DIFFIO_R3n) ; port IO2
IO3: IC1.37(IO,_DIFFIO_R3p) ; port IO3
IO4: IC1.38(IO) ; port IO4
IO5: IC1.40(IO,_CLK2) ; port IO5
IO6: IC1.42(IO,_CLK3) ; port IO6
IO7: IC1.43(IO,_DIFFIO_R2n) ; port IO7
MODBUS_A: J10.4 J11.4
MODBUS_B: J10.6 J11.6
PROJECT_ID0: IC1.55(IO,_DIFFIO_T4p)
PROJECT_ID1: IC1.56(IO,_DIFFIO_T3n)
PROJECT_ID2: IC1.58(IO,_DIFFIO_T3p) NT8.1
PROJECT_ID3: IC1.59(IO,_DIFFIO_T2n) NT12.1
PROJECT_ID4: IC1.60(IO,_DIFFIO_T2p)
PROJECT_ID5: IC1.61(IO,_DIFFIO_T1n) NT9.1
PROJECT_ID6: IC1.62(IO) NT10.1
PROJECT_ID7: IC1.63(IO,_DIFFIO_T1p) NT11.1
RESETn_I: IC1.33(IO,_DIFFIO_B7n) J10.9
RESETn_O: IC1.19(IO,_DIFFIO_B1n) J11.9
REV_ID0: IC1.1(IO,_DIFFIO_L1n) NT1.1
REV_ID1: IC1.10(IO) NT2.1
REV_ID2: IC1.11(IO,_DIFFIO_L3p) NT3.1
REV_ID3: IC1.12(IO,_DIFFIO_L3n) NT4.1
REV_ID4: IC1.13(IO)
REV_ID5: IC1.26(IO,_DIFFIO_B4p) NT5.1
REV_ID6: IC1.27(IO,_DIFFIO_B4n) NT6.1
REV_ID7: IC1.30(IO,_DIFFIO_B6p) NT7.1
RSTn: C6.2 D1.2(A) IC1.29(IO,_DEV_CLRn,_DIFFIO_B5n)
SCL: IC1.9(IO,_CLK1) J10.8 J11.8
SDA: IC1.20(IO,_DIFFIO_B2p) J10.5 J11.5
SPI_CS0: IC1.50(IO,_DIFFIO_T6p) ; port SPI_CS0
SPI_CS1: IC1.51(IO) ; port SPI_CS1
SPI_CS2: IC1.52(IO,_DIFFIO_T5n) ; port SPI_CS2
SPI_CS3: IC1.53(IO,_DIFFIO_T5p) ; port SPI_CS3
SPI_MISO0: IC1.44(IO,_DIFFIO_R2p) ; port SPI_MISO0  [project net SPI_MISO]
SPI_MISO1: IC1.45(IO) ; port SPI_MISO1
SPI_MISO2: IC1.46(IO,_DIFFIO_R1n) ; port SPI_MISO2
SPI_MISO3: IC1.47(IO,_DIFFIO_R1p) ; port SPI_MISO3
SPI_MOSI: IC1.49(IO,_DIFFIO_T6n) ; port SPI_MOSI
SPI_SCLK: IC1.48(IO) ; port SPI_SCLK  [project net SPI_CLK]
STAT_LED: IC1.54(IO,_DIFFIO_T4n) R1.2
TCK: IC1.16(TCK) J1.1
TDI: IC1.15(TDI) J1.9
TDO: IC1.17(TDO) J1.3
TMS: IC1.14(TMS) J1.5
TRG: J4.7 J9.7 ; port TRG
NetLD1_2: LD1.2(A) R1.1
NetLD18_1: LD18.1(C) R26.1
NetLD19_1: LD19.1(C) R27.1
NetLD20_1: LD20.1(C) R32.1
NetLD21_1: LD21.1(C) R33.1
NetLD26_2: LD26.2(A) R46.1
NetLD27_2: LD27.2(A) R48.1
NetLD28_2: LD28.2(A) R2.2
NetR47_1: R47.1 R48.2

Not connected (* = marked no-connect by the designer): IC2 4(NC); IC7 4(NC); J1 6 7 8

### Notes on the sheet
- 0
- 1
- Thermometer ID = 19 (0001 0011)
  REV = 1.0
- to master
- to slave
- Project/Equipment
- Document
- Designer
- Drawn by
- Check.by
- Copyright WUT ISE 2018.
  This documentation describes Open Hardware and is licensed under the CERN OHL v.1.1. You may redistribute and modify this documentation under the terms of the CERN OHL v.1.1. (http://ohwr.org/CERNOHL). This documentation is distributed WITHOUT ANY EXPRESS OR IMPLIED WARRANTY, INCLUDING OF MERCHANTABILITY, SATISFACTORY QUALITY AND FITNESS FOR A PARTICULAR PURPOSE. Please see the CERN OHL v.1.1 for applicable conditions.
- Contact
- File
- Last Mod.
- Print Date
- Sheet
- Size
- A3
- of
- Rev
- (in symbol 5M160ZE64A5N, part A) BANK 1
- (in symbol 5M160ZE64A5N, part B) BANK 2

### Library data of the parts
C1-C9 C231 C232 = CC0402_1UF_16V_10%_X5R: as C18 on sheet THERMO_RTD_SENSOR_2CH; Part Number: CC0402_1UF_16V_10%_X5R; Component Kind: Standard; Component Type: Standard; Pin Count: 2; Value: 1uF; Status: Preferred; Manufacturer Part Number: CC0402_1UF_16V_10%_X5R; Case: 0402; Mounted: Yes; Socket: No; SMD: Yes; Sense: No; Manufacturer1 Example: TDK; Manufacturer1 ComponentHeight: 0.55mm; HelpURL: \\cern.ch\dfs\Applications\Altium\Datasheets\CC0402_X5R_TDK_C.pdf; Author: CERN DEM JLC; CreateDate: 25.10.2012; LatestRevisionDate: 25.10.2012
D1 = BAT165: Schottky Diode; Part Description: Medium Power AF Schottky Diode; Manufacturer: INFINEON; Voltage: 40V; Power: 750mA; PressFit: No; Bonding: No; Part Number: BAT165; Component Kind: Standard; Component Type: Standard; Device: BAT165; PackageDescription: Small Outline Diode (SOD-323), 1.70mm W X 1.25mm L X 1.10mm H body,  IPC Medium Density; Manufacturer Part Number: BAT165; Pin Count: 2; Case: SOD-323; Mounted: Yes; Socket: No; SMD: Yes; Sense: No; ComponentHeight: 1.1mm; HelpURL: \\cern.ch\dfs\Applications\Altium\Datasheets\BAT165.pdf; Author: CERN DEM JLC; CreateDate: 12.11.2014; LatestRevisionDate: 12.11.2014
IC1 = 5M160ZE64A5N: MAX V 1.8V CPLD, 54 IOs, 160 Logic Elements, 64-Pin EQFP, Automotive Temperature, Speed Grade 5, Pb-Free; Manufacturer: ALTERA; PressFit: No; Bonding: No; Part Number: 5M160ZE64A5N; Component Kind: Standard; Component Type: Standard; Device: 5M160ZE64A5N; PackageDescription: QFP, 0.40mm Pitch, Square; 64 pin, 7.00mm L X 7.00mm W X 1.20mm H body (w/Thermal Tab 5.50 X 5.50mm), IPC Medium Density; Status: Not Recommended; Part Description: MAX V 1.8V CPLD, 54 IOs, 160 Logic Elements, 64-Pin EQFP, Automotive Temperature, Speed Grade 5, Pb-Free; Manufacturer Part Number: 5M160ZE64A5N; Pin Count: 65; Case: QFP64; Mounted: Yes; Socket: No; SMD: Yes; Sense: No; ComponentHeight: 1.2mm; HelpURL: \\cern.ch\dfs\Applications\Altium\Datasheets\5M160ZE64A5N.pdf; ComponentLink1URL: \\cern.ch\dfs\Applications\Altium\Datasheets\5M160ZE64A5N_Package.pdf; ComponentLink1Description: Package Drawing; ComponentLink2URL: \\cern.ch\dfs\Applications\Altium\Datasheets\5M160ZE64A5N_Pinout.pdf; ComponentLink2Description: Pinout; Author: CERN DEM JLC; CreateDate: 07.01.2015; LatestRevisionDate: 27.10.2022
IC2 = AP2112K-1.8TRG1: 600mA CMOS Low Dropout Linear Regulator with Enable; Part Description: 1.8V 600mA CMOS Low Dropout Linear Regulator with Enable; Manufacturer: DIODES INCORPORATED; PressFit: No; Bonding: No; Part Number: AP2112K-1.8TRG1; Component Kind: Standard; Component Type: Standard; Device: AP2112K-1.8TRG1; PackageDescription: SOT23, 0.95mm Pitch; 5 Pin, 1.6mm W X 3.0mm L X 1.40mm H body, IPC Medium Density; Manufacturer Part Number: AP2112K-1.8; Pin Count: 5; Case: SOT25; Mounted: Yes; Socket: No; SMD: Yes; Sense: No; ComponentHeight: 1.4mm; HelpURL: \\cern.ch\dfs\Applications\Altium\Datasheets\AP2112K-1.8TRG1.pdf; Author: CERN DEM JLC; CreateDate: 13.06.2018; LatestRevisionDate: 27.06.2022
IC7 = AP2112K-3.3TRG1: 600mA CMOS Low Dropout Linear Regulator with Enable; Part Description: 3.3V 600mA CMOS Low Dropout Linear Regulator with Enable; Manufacturer: DIODES INCORPORATED; PressFit: No; Bonding: No; Part Number: AP2112K-3.3TRG1; Component Kind: Standard; Component Type: Standard; Device: AP2112K-3.3TRG1; PackageDescription: SOT23, 0.95mm Pitch; 5 Pin, 1.6mm W X 3.0mm L X 1.40mm H body, IPC Medium Density; Manufacturer Part Number: AP2112K-3.3; Pin Count: 5; Case: SOT25; Mounted: Yes; Socket: No; SMD: Yes; Sense: No; ComponentHeight: 1.4mm; HelpURL: \\cern.ch\dfs\Applications\Altium\Datasheets\AP2112K-3.3TRG1.pdf; Author: CERN DEM MR; CreateDate: 13.12.2017; LatestRevisionDate: 27.06.2022
J1 = TC2050-IDC: TC2030-MCP and TC2050-IDC Pad Contact; Part Description: 10 X 31mil Diameter SMD Pad For TC2050-IDC Legged Connector; Mounted: No; Part Number: TC2050-IDC; Component Kind: Standard (No BOM); Component Type: Standard (No BOM); Pin Count: 10; Family: TC2050-IDC; Socket: No; SMD: Yes; Sense: No; Status: None; ComponentHeight: 0mm; HelpURL: \\cern.ch\dfs\Applications\Altium\Datasheets\TC2050-IDC.pdf; Author: CERN DEM HF; CreateDate: 02.05.2024; LatestRevisionDate: 02.05.2024; PackageDescription: 10 X 31mil Diameter SMD Pad For TC2030-MCP Legged Connector
J4 J10 = PCB Edge Connector 12 (2x6): Part Number: EDGE10T1B6_P200W1000L0F100X400; Part Description: 10 Contacts Board Edge Connector, Pitch 2mm, Length 0mm, Width 10mm, Finger Lenght 4mm, Finger Width 1mm; Mounted: No; PressFit: No; Component Kind: Standard (No BOM); Component Type: Standard (No BOM); Pin Count: 12; Socket: No; SMD: No; Sense: No; Status: None; ComponentHeight: 0mm; HelpURL: \\cern.ch\dfs\Applications\Altium\Datasheets\EDGE10T1B6_P200W1000L0F100X400.pdf; Author: CERN DEM MR; CreateDate: 14.02.2018; LatestRevisionDate: 14.02.2018
J9 J11 = PCB Edge Connector 12 (2x6) R: PCB Edge Connector 12 (2x6); Part Description: 12 Contacts Board Edge Connector, Pitch 2mm, Length 0mm, Width 10mm, Finger Lenght 4mm, Finger Width 1mm; Mounted: No; PressFit: No; Part Number: EDGE12T5B10_P200W1000L0F100X400; Component Kind: Standard (No BOM); Component Type: Standard (No BOM); Pin Count: 12; Socket: No; SMD: No; Sense: No; Status: None; ComponentHeight: 0mm; HelpURL: \\cern.ch\dfs\Applications\Altium\Datasheets\EDGE10T5B10_P200W1000L0F100X400.pdf; Author: GK; CreateDate: 14.02.2018; LatestRevisionDate: 14.02.2018
LD1 LD18-LD21 LD26-LD28 = LED_KINGBRIGHT_KP-1608CGCK: LED Green 1C 2A; Part Description: 1.6x0.8mm SMD Chip Green LED Lamp; PressFit: No; Bonding: No; Part Number: LED_KINGBRIGHT_KP-1608CGCK; Component Kind: Standard; Component Type: Standard; Color: Green; PackageDescription: SMT Green LED, Case 0603, Body L 1.60mm x W 0.80mm x H 1.10mm; Manufacturer: KINGBRIGHT; Manufacturer Part Number: KP-1608CGCK; Pin Count: 2; Case: 0603; Mounted: Yes; Socket: No; SMD: Yes; Sense: No; ComponentHeight: 1.1mm; HelpURL: \\cern.ch\dfs\Applications\Altium\Datasheets\LED_KINGBRIGHT_KP-1608CGCK.pdf; Author: CERN DEM HF; CreateDate: 01.10.2021; LatestRevisionDate: 01.10.2021
MP1 MP2 = 97730306330R: WA-SMSI SMT Steel Spacer with internal Thread Bottom closed, OD 3.3mm, M1.6 x 3mm; Manufacturer: Wurth Elektronik; Inside Thread Length: 1.8mm; Surface: Tin; ComponentLink1Description: Website Link; ComponentLink1URL: https://www.we-online.com/redexpert/article/97730306330R?ad; ComponentLink2Description: Datasheet Link; ComponentLink2URL: https://www.we-online.com/redexpert/spec/97730306330R?ad; Manufacturer Part Number: 97730306330R; Category: SMT Spacers; Match Code: WA-SMSI; Mount: Surface Mount; Operating Temperature Max: 150°C; Operating Temperature Min: -55°C; Packaging: Tape and Reel; Height: 3mm; Material: Steel; Outside Diameter: 3.3mm; Thread Size: M1.6
NT1-NT12 = Net Tie 3: Part Description: Net Tie (2 Nets); Mounted: No; Part Number: Net Tie 3; Component Type: Net Tie; Pin Count: 2; Family: Net Tie; Socket: No; SMD: No; Sense: No; Status: None; ComponentHeight: 0mm; HelpURL: Undefined; Author: CERN DEM HF; CreateDate: 23.09.2024; LatestRevisionDate: 23.09.2024; PackageDescription: SMD Net Tie
R1 R26 R27 R32 R33 R46-R48 = R0402_3K3_1%_0.0625W_100PPM: as R5 on sheet THERMO_RTD_SENSOR_2CH; Part Number: R0402_3K3_1%_0.0625W_100PPM; Component Kind: Standard; Component Type: Standard; Pin Count: 2; Value: 3k3; Status: Not Recommended; Power: 0.0625W; Manufacturer Part Number: R0402_3K3_1%_0.0625W_100PPM; Case: 0402; Mounted: Yes; Sense: No; Socket: No; SMD: Yes; Manufacturer1 Example: YAGEO PHYCOMP; Manufacturer1 ComponentHeight: 0.4mm; HelpURL: \\cern.ch\dfs\Applications\Altium\Datasheets\R0402_Phycomp_RC0402.pdf; Author: CERN DEM JLC; CreateDate: 03.12.2007; LatestRevisionDate: 17.10.2012
R2 = R0402_10K_1%_0.0625W_100PPM: Resistor - 1%; Part Description: General Purpose Thick Film Chip Resistor; Manufacturer: GENERIC; Manufacturer1 Part Number: 232270671003L; TC: ±100ppm/°C; PressFit: No; Part Number: R0402_10K_1%_0.0625W_100PPM; Component Kind: Standard; Component Type: Standard; Pin Count: 2; Value: 10k; Status: Not Recommended; Power: 0.0625W; Manufacturer Part Number: R0402_10K_1%_0.0625W_100PPM; Case: 0402; Mounted: Yes; Sense: No; Socket: No; SMD: Yes; Manufacturer1 Example: YAGEO PHYCOMP; Manufacturer1 ComponentHeight: 0.4mm; HelpURL: \\cern.ch\dfs\Applications\Altium\Datasheets\R0402_Phycomp_RC0402.pdf; Author: CERN DEM JLC; CreateDate: 03.12.2007; LatestRevisionDate: 17.10.2012
SW2 = SW_OMRON_A6H-4102: 4 Ways SPST DIP Switch; Part Description: 4 Ways Ultra-low Profile, Half-pitch, SPST DIP Switch with Seal Tape, Rating 25mA 24VDC; Manufacturer: OMRON; PressFit: No; Part Number: SW_OMRON_A6H-4102; Component Kind: Standard; Component Type: Standard; Pin Count: 8; PackageDescription: Pitch 1.27mm, Body 6.31 x 4.5mm, 4 Ways SPST Surface-Mounting DIP Switch, OMRON A6H; Family: Switch; Mounted: Yes; Socket: No; SMD: Yes; Sense: No; Status: None; Manufacturer Part Number: A6H-4102; ComponentHeight: 1.45mm; HelpURL: \\cern.ch\dfs\Applications\Altium\Datasheets\SW_OMRON_A6H-4102.pdf; Author: CERN DEM JLC; CreateDate: 17.12.2013; LatestRevisionDate: 17.12.2013

## Nets that join several sheets
GND: THERMO_RTD_SENSOR_2CH (58 pins), SPI_IFC (48 pins)
P3V3: THERMO_RTD_SENSOR_2CH (IC4.7 R30.2 R40.1 R41.1), SPI_IFC (17 pins)
P5V0: THERMO_RTD_SENSOR_2CH (C14.2 IC5.1 IC5.6 L2.1), SPI_IFC (9 pins)
SPI_CLK: THERMO_RTD_SENSOR_2CH (IC8.13), SPI_IFC (IC1.48)
SPI_CS0: THERMO_RTD_SENSOR_2CH (IC8.14), SPI_IFC (IC1.50)
SPI_CS2: THERMO_RTD_SENSOR_2CH (R41.2), SPI_IFC (IC1.52)
SPI_CS3: THERMO_RTD_SENSOR_2CH (R40.2), SPI_IFC (IC1.53)
SPI_MISO: THERMO_RTD_SENSOR_2CH (IC8.11), SPI_IFC (IC1.44)
SPI_MOSI: THERMO_RTD_SENSOR_2CH (IC8.12), SPI_IFC (IC1.49)